# EAGLE schematic afron_atmega328_chassis_SMD (EAGLE 6.1)
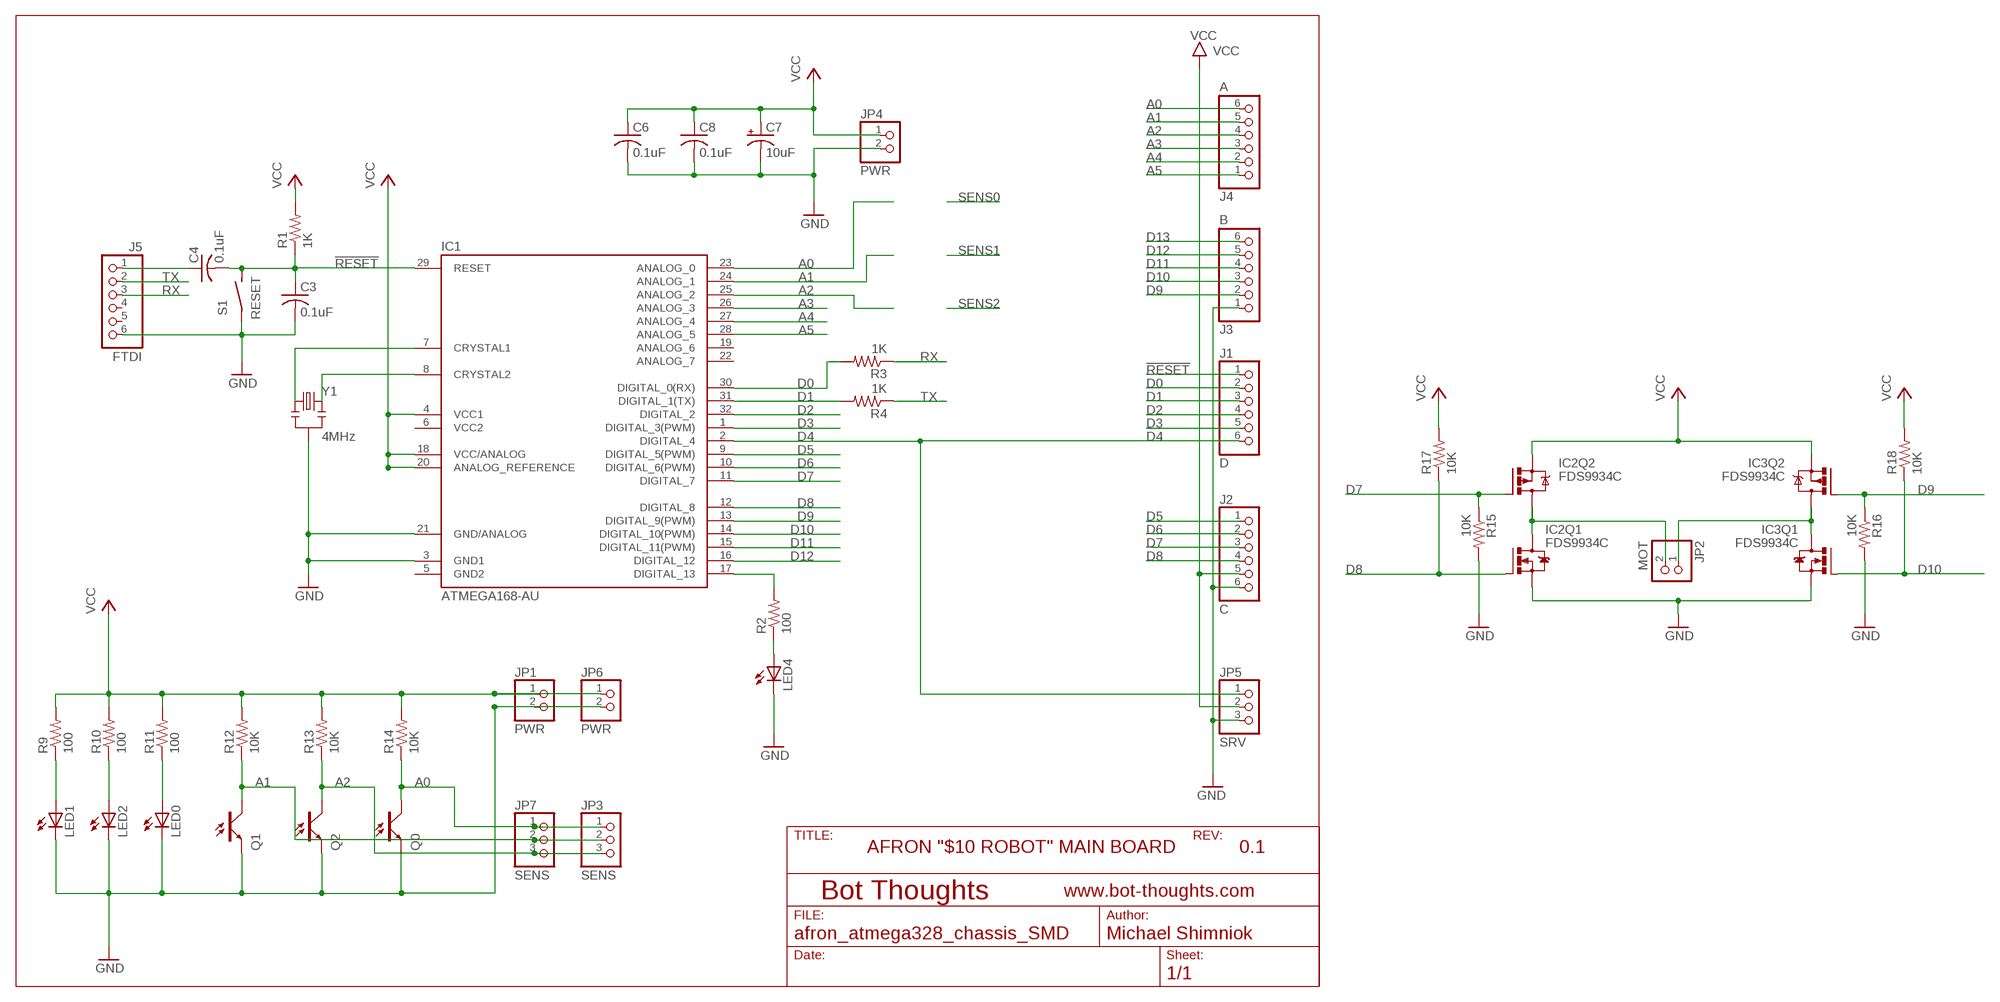
[diagram p0: schematic, sheet 1]

## Parts
C3  0.1uF  C-USC0603  [C0603]
C4  0.1uF  C-USC0603  [C0603]
C6  0.1uF  C-USC0603  [C0603]
C7  10uF  CPOL-USE2.5-6  [E2,5-6]
C8  0.1uF  C-USC0603  [C0603]
IC1  ATMEGA168-AU  [TQFP32-08]
IC2  FDS9934C  [SOIC8]
IC3  FDS9934C  [SOIC8]
J1  D  PINHD-1X06_2.54-S  [1X06-S]
J2  C  PINHD-1X06_2.54-S  [1X06-S]
J3  B  PINHD-1X06_2.54-S  [1X06-S]
J4  A  PINHD-1X06_2.54-S  [1X06-S]
J5  FTDI  PINHD-1X06_2.54-S  [1X06-S]
JP1  PWR  PINHD-1X02_2.54-S  [1X02-S]
JP2  MOT  PINHD-1X02_2.54-S  [1X02-S]
JP3  SENS  PINHD-1X03_2.54-S  [1X03-S]
JP4  PWR  PINHD-1X02_2.54-S  [1X02-S]
JP5  SRV  PINHD-1X03_2.54-S  [1X03-S]
JP6  PWR  PINHD-1X02_2.54-S  [1X02-S]
JP7  SENS  PINHD-1X03_2.54-S  [1X03-S]
LED0  LED3MM  [LED3MM]
LED1  LED3MM  [LED3MM]
LED2  LED3MM  [LED3MM]
LED4  LEDCHIP-LED0603  [CHIP-LED0603]
Q0  PHOTOTRANSISTOR3MM  [LED3MM]
Q1  PHOTOTRANSISTOR3MM  [LED3MM]
Q2  PHOTOTRANSISTOR3MM  [LED3MM]
R1  1K  R-US_R0603  [R0603]
R2  100  R-US_R0603  [R0603]
R3  1K  R-US_R0603  [R0603]
R4  1K  R-US_R0603  [R0603]
R9  100  R-US_R0603  [R0603]
R10  100  R-US_R0603  [R0603]
R11  100  R-US_R0603  [R0603]
R12  10K  R-US_R0603  [R0603]
R13  10K  R-US_R0603  [R0603]
R14  10K  R-US_R0603  [R0603]
R15  10K  R-US_R0603  [R0603]
R16  10K  R-US_R0603  [R0603]
R17  10K  R-US_R0603  [R0603]
R18  10K  R-US_R0603  [R0603]
S1  RESET  SPST_TACT_RECT_SMD  [6MMTACTTILE_RECT_SMD]
Y1  4MHz  RESONATORSMD  [RESONATOR-SMD]

## Nets
!RESET: C3.1 C4.2 IC1.29(RESET) J1.1 R1.1 S1.P$2(S)
A0: IC1.23(ANALOG_0) J4.6 JP3.1 JP7.1 Q0.A R14.1
A1: IC1.24(ANALOG_1) J4.5 JP3.2 JP7.2 Q1.A R12.1
A2: IC1.25(ANALOG_2) J4.4 JP3.3 JP7.3 Q2.A R13.1
A3: IC1.26(ANALOG_3) J4.3
A4: IC1.27(ANALOG_4) J4.2
A5: IC1.28(ANALOG_5) J4.1
D0: IC1.30(DIGITAL_0(RX)) J1.2 R3.2
D1: IC1.31(DIGITAL_1(TX)) J1.3 R4.2
D2: IC1.32(DIGITAL_2) J1.4
D3: IC1.1(DIGITAL_3(PWM)) J1.5
D4: IC1.2(DIGITAL_4) J1.6 JP5.1
D5: IC1.9(DIGITAL_5(PWM)) J2.1
D6: IC1.10(DIGITAL_6(PWM)) J2.2
D7: IC1.11(DIGITAL_7) IC2.4(Q2:G) J2.3 R15.1
D8: IC1.12(DIGITAL_8) IC2.2(Q1:G) J2.4 R17.1
D9: IC1.13(DIGITAL_9(PWM)) IC3.4(Q2:G) J3.2 R16.1
D10: IC1.14(DIGITAL_10(PWM)) IC3.2(Q1:G) J3.3 R18.1
D11: IC1.15(DIGITAL_11(PWM)) J3.4
D12: IC1.16(DIGITAL_12) J3.5
D13: IC1.17(DIGITAL_13) J3.6 R2.2
GND: C3.2 C6.2 C7.- C8.2 IC1.3(GND1) IC1.21(GND/ANALOG) IC2.1(Q1:S) IC3.1(Q1:S) J2.6 J3.1 J5.6 JP1.2 JP4.2 JP5.3 JP6.2 LED0.K(C) LED1.K(C) LED2.K(C) LED4.C Q0.K(C) Q1.K(C) Q2.K(C) R15.2 R16.2 S1.P$1(P) Y1.2
MA: IC2.5(Q2:D) IC2.6(Q2:D) IC2.7(Q1:D) IC2.8(Q1:D) JP2.2
MB: IC3.5(Q2:D) IC3.6(Q2:D) IC3.7(Q1:D) IC3.8(Q1:D) JP2.1
N$1: LED0.A R11.1
N$2: IC1.7(CRYSTAL1) Y1.1
N$3: IC1.8(CRYSTAL2) Y1.3
N$4: C4.1 J5.1
N$5: LED2.A R10.1
N$6: LED4.A R2.1
N$7: LED1.A R9.1
RX: J5.3 R3.1
TX: J5.2 R4.1
VCC: C6.1 C7.+ C8.1 IC1.4(VCC1) IC1.18(VCC/ANALOG) IC1.20(ANALOG_REFERENCE) IC2.3(Q2:S) IC3.3(Q2:S) J2.5 JP1.1 JP4.1 JP5.2 JP6.1 R1.2 R9.2 R10.2 R11.2 R12.2 R13.2 R14.2 R17.2 R18.2
Unconnected: IC1.19(ANALOG_6) IC1.22(ANALOG_7) J5.4 J5.5

## Notes on the sheet
- AFRON "$10 ROBOT" MAIN BOARD | 0.1

## Power pins joined to a net without a drawn wire
GND2: IC1.5(GND2)
VCC2: IC1.6(VCC2)

## Library data of the parts
C3 C4 C6 C8 = rcl:C-US: CAPACITOR, American symbol
C7 = rcl:CPOL-US: POLARIZED CAPACITOR, American symbol
IC1 = Arduino-AVR:ATMEGA168
IC2 IC3 = mes_motor_driver:FDS9934C: Complementary MOSFET These dual N- and P-Channel enhancement mode power field effect transistors are produced using Fairchild Semiconductor’s advanced PowerTrench process that has been especially tailored to minimize on-state ressitance and yet maintain superior switching performance. These devices are well suited for low voltage and battery powered applications where low in-line power loss and fast switching are required. http://www.fairchildsemi.com/ds/FD/FDS9934C.pdf
J1-J5 = pinhead-2:PINHD-1X06: PIN HEADER
JP1 JP2 JP4 JP6 = pinhead-2:PINHD-1X02: PIN HEADER
JP3 JP5 JP7 = pinhead-2:PINHD-1X03: PIN HEADER
LED0 LED1 LED2 LED4 = led:LED: LED OSRAM: - CHIPLED LG R971, LG N971, LY N971, LG Q971, LY Q971, LO R971, LY R971 LH N974, LH R974 LS Q976, LO Q976, LY Q976 LO Q996 - Hyper CHIPLED LW Q18S LB Q993, LB Q99A, LB R99A - SideLED LS A670, LO A670, LY A670, LG A670, LP A670 LB A673, LV A673, LT A673, LW A673 LH A674 LY A675 LS A676, LA A676, LO A676, LY A676, LW A676 LS A679, LY A679, LG A679 - Hyper Micro SIDELED® LS Y876, LA Y876, LO Y876, LY Y876 LT Y87S - SmartLED LW L88C, LW L88S LB L89C, LB L89S, LG L890 LS L89K, LO L89K, LY L89K LS L896, LA L896, LO L896, LY L896 - TOPLED LS T670, LO T670, LY T670, LG T670, LP T670 LSG T670, LSP T670, LSY T670, LOP T670, LYG T670 LG T671, LOG T671, LSG T671 LB T673, LV T673, LT T673, LW T673 LH T674 LS T676, LA T676, LO T676, LY T676, LB T676, LH T676, LSB T676, LW T676 LB T67C, LV T67C, LT T67C, LS T67K, LO T67K, LY T67K, LW E67C LS E67B, LA E67B, LO E67B, LY E67B, LB E67C, LV E67C, LT E67C LW T67C LS T679, LY T679, LG T679 LS T770, LO T770, LY T770, LG T770, LP T770 LB T773, LV T773, LT T773, LW T773 LH T774 LS E675, LA E675, LY E675, LS T675 LS T776, LA T776, LO T776, LY T776, LB T776 LHGB T686 LT T68C, LB T68C - Hyper Mini TOPLED® LB M676 - Mini TOPLED Santana® LG M470 LS M47K, LO M47K, LY M47K Source: http://www.osram.convergy.de LUXEON: - LUMILED® LXK2-PW12-R00, LXK2-PW12-S00, LXK2-PW14-U00, LXK2-PW14-V00 LXK2-PM12-R00, LXK2-PM12-S00, LXK2-PM14-U00 LXK2-PE12-Q00, LXK2-PE12-R00, LXK2-PE12-S00, LXK2-PE14-T00, LXK2-PE14-U00 LXK2-PB12-K00, LXK2-PB12-L00, LXK2-PB12-M00, LXK2-PB14-N00, LXK2-PB14-P00, LXK2-PB14-Q00 LXK2-PR12-L00, LXK2-PR12-M00, LXK2-PR14-Q00, LXK2-PR14-R00 LXK2-PD12-Q00, LXK2-PD12-R00, LXK2-PD12-S00 LXK2-PH12-R00, LXK2-PH12-S00 LXK2-PL12-P00, LXK2-PL12-Q00, LXK2-PL12-R00 Source: www.luxeon.com KINGBRIGHT: KA-3528ASYC Source: www.kingbright.com
Q0 Q1 Q2 = mes_opto:PHOTOTRANSISTOR: Phototransistor
R1-R4 R9-R18 = resistor:R-US_: RESISTOR, American symbol
S1 = mes_electromech:SPST: SPST SWITCH
Y1 = SparkFun:RESONATOR: Resonator Small SMD resonator. This is the itty bitty 10/20MHz resonators with built in caps. CSTCE10M0G55 and CSTCE20M0V53. Footprint has been reviewed closely but hasn't been tested yet.